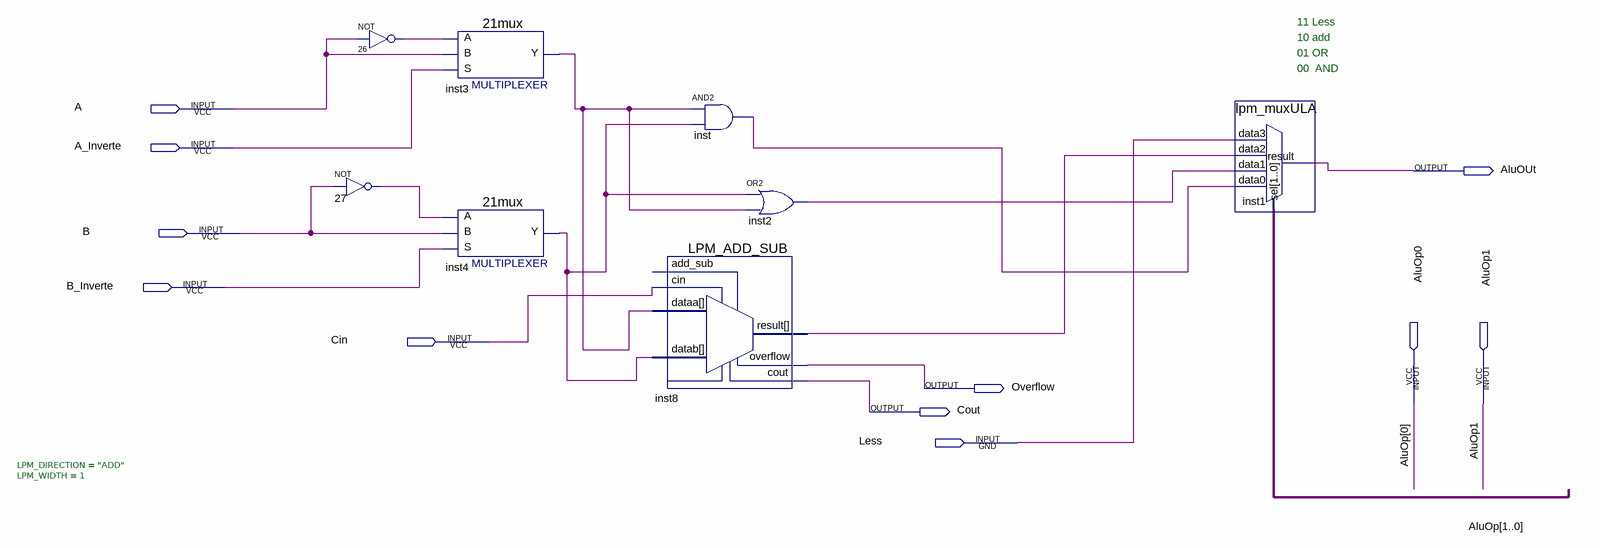
[diagram p0: schematic sheet]
// Quartus schematic ula.bdf as structural Verilog: 8 symbols, 11 pins
module ula (
  input  A,
  input  A_Inverte,
  input  B,
  input  B_Inverte,
  input  Cin,
  input  AluOp0,
  input  AluOp1,
  input  Less,
  output AluOUt,
  output Overflow,
  output Cout
);

  wire inst2_out, inst3_y, inst4_y, inst8_result, inst_out, n26_out, n27_out;

  not u_26 (n26_out, A);
  not u_27 (n27_out, B);
  \21mux  inst3 (.S(A_Inverte), .B(A), .A(n26_out), .Y(inst3_y));
  \21mux  inst4 (.S(B_Inverte), .B(B), .A(n27_out), .Y(inst4_y));
  LPM_ADD_SUB #(.LPM_DIRECTION("ADD"), .LPM_WIDTH(1)) inst8 (
    .cin(Cin), .dataa(inst3_y), .datab(inst4_y), .cout(Cout), .overflow(Overflow), .result(inst8_result));  // open: add_sub
  and inst (inst_out, inst3_y, inst4_y);
  or inst2 (inst2_out, inst4_y, inst3_y);
  lpm_muxULA inst1 (
    .data3(Less), .data2(inst8_result), .data1(inst2_out), .data0(inst_out), .sel({AluOp1, AluOp0}),
    .result(AluOUt));

  // Notes on the sheet:
  //   11 Less
  //   10 add
  //   01 OR
  //   00  AND
endmodule
